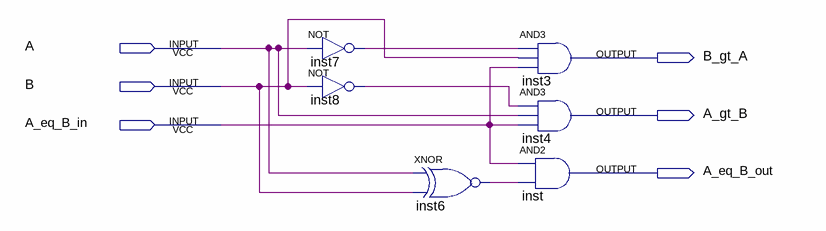
[diagram p0: schematic sheet]
// Quartus schematic comparadorcompleto.bdf as structural Verilog: 6 symbols, 6 pins
module comparadorcompleto (
  input  A,
  input  B,
  input  A_eq_B_in,
  output B_gt_A,
  output A_gt_B,
  output A_eq_B_out
);

  wire inst6_out, inst7_out, inst8_out;

  not inst7 (inst7_out, A);
  not inst8 (inst8_out, B);
  xnor inst6 (inst6_out, A, B);
  and inst3 (B_gt_A, inst7_out, B, A_eq_B_in);
  and inst4 (A_gt_B, inst8_out, A, A_eq_B_in);
  and inst (A_eq_B_out, A_eq_B_in, inst6_out);
endmodule
